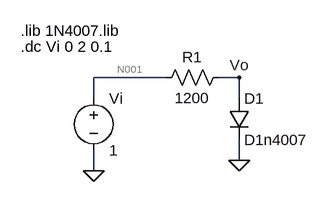
[diagram p0: schematic Sim_1N4007.asc]
Sim_1N4007.asc, the LTspice schematic file:
Version 4
SHEET 1 880 680
WIRE 176 128 64 128
WIRE 288 128 256 128
WIRE 64 160 64 128
WIRE 288 160 288 128
WIRE 288 256 288 224
WIRE 64 272 64 240
FLAG 288 256 0
FLAG 64 272 0
FLAG 288 128 Vo
SYMBOL diode 272 160 R0
SYMATTR InstName D1
SYMATTR Value D1n4007
SYMBOL res 272 112 R90
WINDOW 0 0 56 VBottom 2
WINDOW 3 32 56 VTop 2
SYMATTR InstName R1
SYMATTR Value 1200
SYMBOL voltage 64 144 R0
WINDOW 123 0 0 Left 2
WINDOW 39 0 0 Left 2
SYMATTR InstName Vi
SYMATTR Value 1
TEXT -48 80 Left 2 !.dc Vi 0 2 0.1
TEXT -48 56 Left 2 !.lib 1N4007.lib

The netlist it stands for:
* Sim_1N4007.asc
D1 Vo 0 D1n4007
R1 Vo N001 1200
Vi N001 0 1
.model D D
.lib standard.dio
.dc Vi 0 2 0.1
.lib 1N4007.lib
.backanno
.end

* Results of the author's LTspice run, read from the files saved beside the schematic
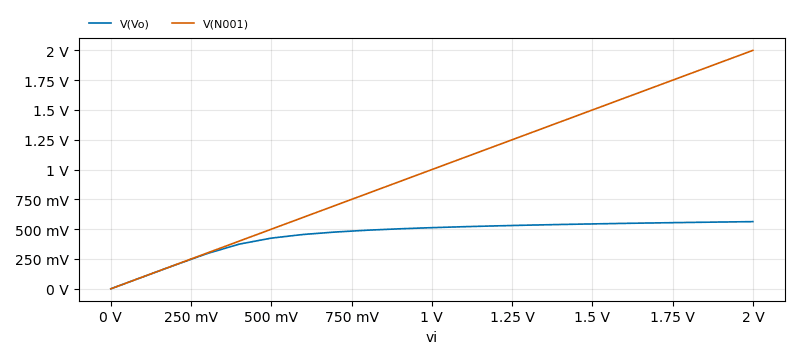
[diagram p1: DC transfer characteristic of Sim_1N4007.asc, plotted from the saved traces]
* DC transfer characteristic, 1 run:
*   V(Vo): 0 V at vi=0 V, 563.4 mV at vi=2 V, min 0 V, max 563.4 mV
*   V(N001): 0 V at vi=0 V, 2 V at vi=2 V, min 0 V, max 2 V